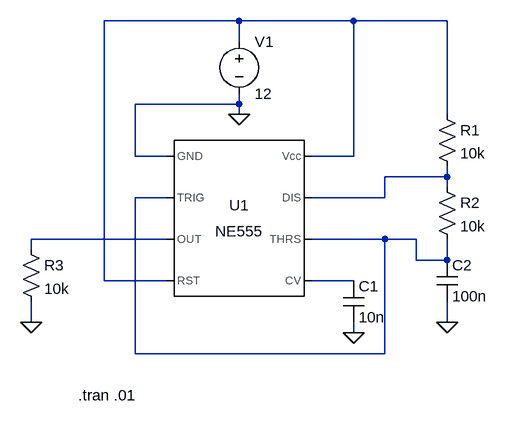
[diagram p0: schematic ne555-astabile.asc]
ne555-astabile.asc, the LTspice schematic file:
Version 4
SHEET 1 880 680
WIRE 416 32 208 32
WIRE 592 32 416 32
WIRE 736 32 592 32
WIRE 416 64 416 32
WIRE 416 160 416 144
WIRE 416 160 256 160
WIRE 416 176 416 160
WIRE 736 176 736 32
WIRE 256 240 256 160
WIRE 304 240 256 240
WIRE 592 240 592 32
WIRE 592 240 528 240
WIRE 736 272 736 256
WIRE 736 272 640 272
WIRE 736 288 736 272
WIRE 304 304 256 304
WIRE 640 304 640 272
WIRE 640 304 528 304
WIRE 304 368 96 368
WIRE 640 368 528 368
WIRE 688 368 640 368
WIRE 96 384 96 368
WIRE 688 400 688 368
WIRE 736 400 736 368
WIRE 736 400 688 400
WIRE 208 432 208 32
WIRE 304 432 208 432
WIRE 592 432 528 432
WIRE 96 496 96 464
WIRE 736 496 736 464
WIRE 592 512 592 496
WIRE 256 544 256 304
WIRE 640 544 640 368
WIRE 640 544 256 544
FLAG 416 176 0
FLAG 592 512 0
FLAG 736 496 0
FLAG 96 496 0
SYMBOL Misc/NE555 416 336 R0
SYMATTR InstName U1
SYMBOL res 720 160 R0
SYMATTR InstName R1
SYMATTR Value 10k
SYMBOL res 720 272 R0
SYMATTR InstName R2
SYMATTR Value 10k
SYMBOL cap 576 432 R0
SYMATTR InstName C1
SYMATTR Value 10n
SYMBOL cap 720 400 R0
SYMATTR InstName C2
SYMATTR Value 100n
SYMBOL voltage 416 48 R0
SYMATTR InstName V1
SYMATTR Value 12
SYMBOL res 80 368 R0
SYMATTR InstName R3
SYMATTR Value 10k
TEXT 168 608 Left 2 !.tran .01

The netlist it stands for:
* ne555-astabile.asc
XU1 0 N003 N004 N001 N005 N003 N002 N001 NE555  ; pins GND TRIG OUT RST CV THRS DIS Vcc
R1 N001 N002 10k
R2 N002 N003 10k
C1 N005 0 10n
C2 N003 0 100n
V1 N001 0 12
R3 N004 0 10k
.tran .01
.lib NE555.sub
.backanno
.end